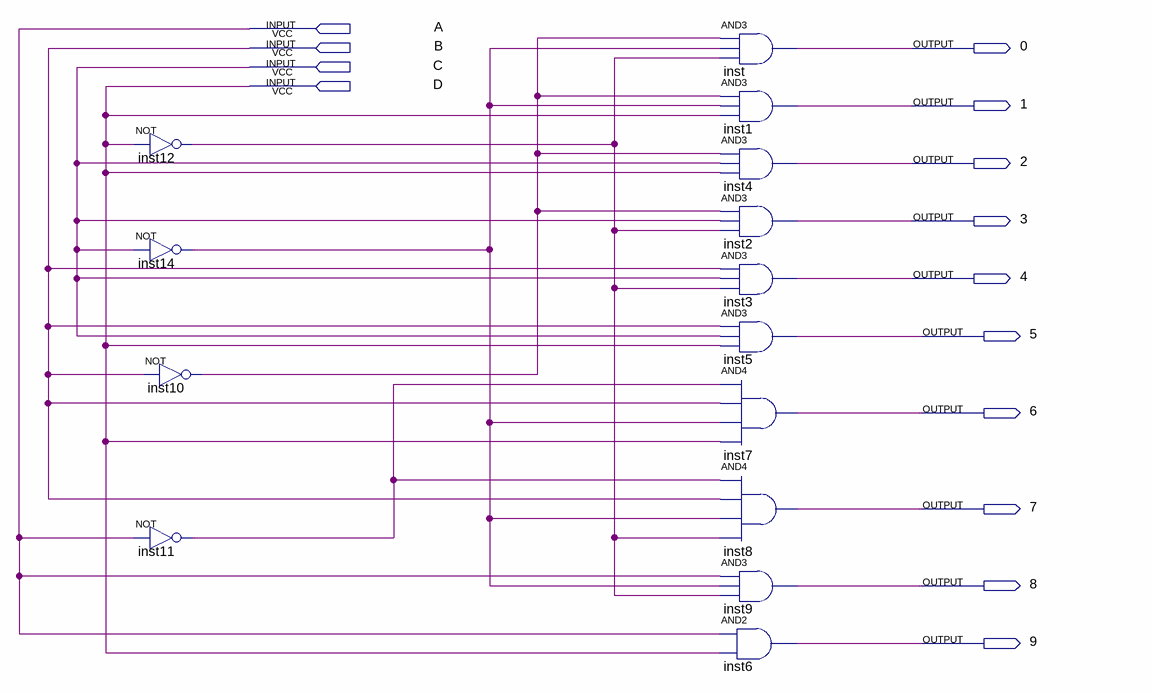
[diagram p0: schematic sheet]
// Quartus schematic decoder.bdf as structural Verilog: 14 symbols, 14 pins
module decoder (
  input  A,
  input  B,
  input  C,
  input  D,
  output \0 ,
  output \1 ,
  output \2 ,
  output \3 ,
  output \4 ,
  output \5 ,
  output \6 ,
  output \7 ,
  output \8 ,
  output \9 
);

  wire inst10_out, inst11_out, inst12_out, inst14_out;

  not inst12 (inst12_out, D);
  not inst14 (inst14_out, C);
  not inst10 (inst10_out, B);
  not inst11 (inst11_out, A);
  and inst (\0 , inst10_out, inst14_out, inst12_out);
  and inst1 (\1 , inst10_out, inst14_out, D);
  and inst4 (\2 , inst10_out, C, D);
  and inst2 (\3 , inst10_out, C, inst12_out);
  and inst3 (\4 , B, C, inst12_out);
  and inst5 (\5 , B, C, D);
  and inst7 (\6 , inst11_out, B, inst14_out, D);
  and inst8 (\7 , inst11_out, B, inst14_out, inst12_out);
  and inst9 (\8 , A, inst14_out, inst12_out);
  and inst6 (\9 , A, D);
endmodule
